# Altium schematic sheet Remote.SchDoc
size 431 x 279 mm; SheetNumber: 1; SheetTotal: 1; ENG_APP_DATE: --/--/--; DSN_APP_DATE: --/--/--; CHK_APP_DATE: --/--/--
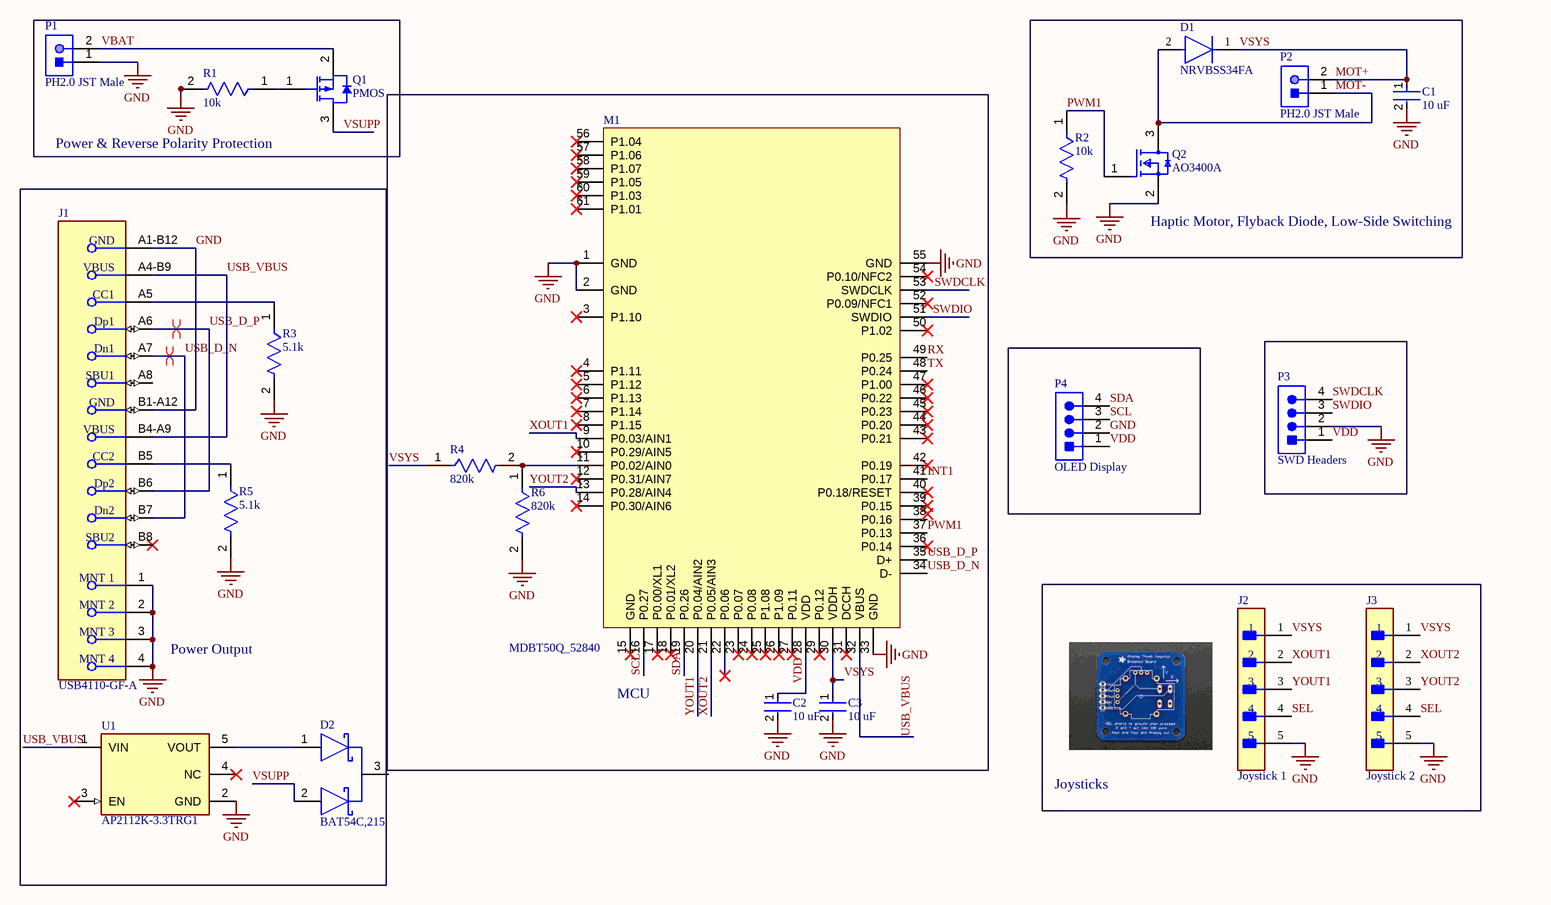
[diagram p0: Remote.SchDoc]

## Parts
C1  10 uF  [FP-1210-L_3_3_0_4-W_2_5_0-IPC_A]
C2  10 uF  [FP-1210-L_3_3_0_4-W_2_5_0-IPC_A]
C3  10 uF  [FP-1210-L_3_3_0_4-W_2_5_0-IPC_A]
D1  NRVBSS34FA  [FP-425AB-MFG]
D2  BAT54C,215  [FP-SOT23-MFG]
J1  USB4110-GF-A  [FP-USB4110-GF-A-MFG]
J2  Joystick 1  [FP-22-28-4050-MFG]
J3  Joystick 2  [FP-22-28-4050-MFG]
M1  MDBT50Q_52840  [MDBT50Q]
P1  PH2.0 JST Male  [JST-S2B-PH-K-S_V]
P2  PH2.0 JST Male  [JST-S2B-PH-K-S_V]
P3  SWD Headers  [SLIN-GRPB041VWVN-RC_V]
P4  OLED Display  [SLIN-GRPB041VWVN-RC_V]
Q1  PMOS  [AO-SOT-23-3L_V]
Q2  AO3400A  [FP-SOT23-MFG]
R1  10k  [FP-CRGCQ1210-IPC_C]
R2  10k  [FP-CRGCQ1210-IPC_C]
R3  5.1k  [FP-ESR10-IPC_C]
R4  820k  [FP-AC1206-MFG]
R5  5.1k  [FP-ESR10-IPC_C]
R6  820k  [FP-AC1206-MFG]
U1  AP2112K-3.3TRG1  [FP-SOT25-IPC_A]

## Blocks framed on the sheet
Power & Reverse Polarity Protection: P1 Q1 R1
Haptic Motor, Flyback Diode, Low-Side Switching: C1 D1 P2 Q2 R2
MCU: C2 C3 M1 R4 R6
Power Output: D2 J1 R3 R5 U1
Joysticks: J2 J3

## Nets
GND: C1.2 C2.2 C3.2 J1.1(MNT_1) J1.2(MNT_2) J1.3(MNT_3) J1.4(MNT_4) J1.A1-B12(GND) J1.B1-A12(GND) J2.5 J3.5 M1.1(GND) M1.2(GND) M1.33(GND) M1.55(GND) P1.1 P3.2 P4.2 Q2.2(S) R1.2 R2.2 R3.2 R5.2 R6.2 U1.2(GND)
INT1: M1.41(P0.17)
MOT+: C1.1 C3.1 D1.1(C) J2.1 J3.1 M1.30(VDDH) P2.2 R4.1  [also labelled VSYS]
MOT-: D1.2(A) P2.1 Q2.3(D)
PWM1: M1.37(P0.13) Q2.1(G) R2.1
RX: M1.49(P0.25)
SCL: M1.16(P0.27) P4.3
SDA: M1.19(P0.26) P4.4
SEL: J2.4 J3.4
SWDCLK: M1.53(SWDCLK) P3.4
SWDIO: M1.51(SWDIO) P3.3
TX: M1.48(P0.24)
USB_D_N: J1.A7(Dn1) J1.B7(Dn2) M1.34(D-)
USB_D_P: J1.A6(Dp1) J1.B6(Dp2) M1.35(D+)
USB_VBUS: J1.A4-B9(VBUS) J1.B4-A9(VBUS) M1.32(VBUS) U1.1(VIN)
VBAT: P1.2 Q1.2(SOURCE)
VDD: C2.1 M1.28(VDD) P3.1 P4.1
VSUPP: D2.2(2_ANODE) Q1.3(DRAIN)
XOUT1: J2.2 M1.9(P0.03/AIN1)
XOUT2: J3.2 M1.21(P0.05/AIN3)
YOUT1: J2.3 M1.20(P0.04/AIN2)
YOUT2: J3.3 M1.13(P0.28/AIN4)
NetD2_1: D2.1(1_ANODE) U1.5(VOUT)
NetJ1_A5: J1.A5(CC1) R3.1
NetJ1_B5: J1.B5(CC2) R5.1
NetM1_11: M1.11(P0.02/AIN0) R4.2 R6.1
NetQ1_1: Q1.1(GATE) R1.1

Not connected (* = marked no-connect by the designer): D2 3(COMMON_CATHODE); J1 A8(SBU1) B8(SBU2)*; M1 3(P1.10)* 4(P1.11)* 5(P1.12)* 6(P1.13)* 7(P1.14)* 8(P1.15)* 10(P0.29/AIN5)* 12(P0.31/AIN7)* 14(P0.30/AIN6)* 15(GND)* 17(P0.00/XL1)* 18(P0.01/XL2)* 22(P0.06)* 23(P0.07)* 24(P0.08)* 25(P1.08)* 26(P1.09)* 27(P0.11)* 29(P0.12)* 31(DCCH)* 36(P0.14)* 38(P0.16) 39(P0.15)* 40(P0.18/RESET)* 42(P0.19)* 43(P0.21)* 44(P0.20)* 45(P0.23)* 46(P0.22)* 47(P1.00)* 50(P1.02)* 52(P0.09/NFC1)* 54(P0.10/NFC2)* 56(P1.04)* 57(P1.06)* 58(P1.07)* 59(P1.05)* 60(P1.03)* 61(P1.01)*; U1 3(EN)* 4(NC)*

## Layout directives
differential pair: USB_D_N, USB_D_P

## Notes on the sheet
- DWG. NO.
- REV.
- SHT.
- THIS DOCUMENT AND THE DATA DISCLOSED HEREIN OR HEREWITH IS THE PROPERTY OF ALTIUM LIMITED AND MAY BE FREELY DISTRIBUTED IN WHOLE. NO RIGHTS ARE RESERVED OR EXPRESS OR IMPLIED WARANTEE GIVEN.
- REVISION
- DESCRIPTION
- DATE
- APPROVED
- ENG:
- APPROVALS
- PROJECT
- DSN:
- CHK:
- REFERENCE DOCUMENTS
- PROJECT REVISION:
- TITLE
- DOCUMENT REVISION:
- DESIGN ITEM:
- BOM:
- FAB DWG:
- PCB DWG:
- ASSY DWG:
- SCALE:
- SIZE
- B
- CAGE CODE
- FILE NAME
- DWG NO.
- SHEET
- OF
- REV

## Library data of the parts
C1-C3 = CMP-1038-02198-3: CAP CER 10UF 10V X7R 1210, 1210ZC106KAT2A; Dissipation Factor: 5%; Tolerance: 10%; Capacitance: 10uF; Voltage Rating (DC): 10V; Case Code (Imperial): 1210; Termination: SMD/SMT; Min Operating Temperature: -55°C; Max Operating Temperature: 125°C; Voltage: 10V; RoHS Compliant: Yes; Lead Free: Lead Free; Construction: Flat; Case/Package: 1210; Dielectric: X7R; Width: 0.098inch; REACH SVHC: No SVHC; Mount: Surface Mount; Case Code (Metric): 3225; Depth: 2.5mm; Series: 1210; Voltage Rating: 10V; Packaging: Tape and Reel; Length: 3.2mm; Thickness: 0.11inch; Package Quantity: 1; Height: 2.79mm; Radiation Hardening: No
D1 = CMP-00278-103808874-1: NRVBSS34FA Schottky Barrier Rectifier Diode 40V 3A 2-Pin SOD−123FL T/R; Manufacturer Lifecycle Status: ACTIVE; Max Junction Temperature (Tj): 125°C; Capacitance: 152pF; Peak Reverse Current: 500µA; Max Forward Surge Current (Ifsm): 80A; RoHS: Compliant; Forward Current: 3A; Height: 1.43mm; Max Operating Temperature: 125°C; Min Operating Temperature: -55°C; Lifecycle Status: Production; Max Repetitive Reverse Voltage (Vrrm): 40V; Reverse Voltage: 40V; NexarPartId: 103808874
D2 = CMP-14398-000007-1: DIODE ARRAY SCHOTTKY 30V SOT23; Manufacturer: Nexperia; Automotive Grade: Grade 0; Peak Reverse Current: 2uA; Forward Current: 200mA; Max Surge Forward Current: 600mA; Value: 10pF; Max Junction Temp: +150°C; Lead Free: Yes; Automotive: Yes; Device Class L1: Discrete Semiconductors; Digikey Description: DIODE ARRAY SCHOTTKY 30V SOT23; Reverse Voltage: 30V; ComponentLink2URL: https://assets.nexperia.com/documents/data-sheet/BAT54_SER.pdf; Device Class L2: Diodes; Category: Diode; Octopart: https://octopart.com/bat54c%2C215-nexperia-78738945; Package: SOT23; Mouser Description: Schottky Diodes, Rectifiers - Arrays SOT-23 (TO-236AB) 30V 200mA (DC) Surface Mount; RoHS: TRUE; Manufacturer Part Number: BAT54C,215; Temperature: to +150°C; Ambient Temperature Range Low: -55°C; Height: 1.1mm; Device Class L3: Schottky Diodes; Temperature Range High: +150°C; Footprint Url: https://assets.nexperia.com/documents/outline-drawing/SOT23.pdf; Capacitance: 10pF; Ambient Temperature Range High: +150°C; Ipc Land Pattern Name: SOT95P230X100-3; ComponentLink2Description: Datasheet
J1 = CMP-245163-000002-1: CONN USB 2.0 TYPE-C R/A SMT; Manufacturer: GCT; Conn Orientation: Right Angle; Usb Standard: USB 2.0; Voltage Rating: 20V; Current Rating: 3/4.25/1.25/0.25A; Number Of Contacts: 16; Is Female: yes; Shielding: true; Standoff Height: 0.1mm; Octopart: https://octopart.com/usb4110-gf-a-gct-103941985; Temperature: -40°C to +85°C; RoHS: TRUE; Automotive: No; Contact Material: Gold,Nickel; Device Class L1: Connectors; Device Class L2: USB Connectors; Package: 0; Lead Free: Yes; ComponentLink2URL: https://gct.co/files/drawings/usb4110.pdf; Temperature Range High: +85°C; Temperature Range Low: -40°C; Height: 3.46mm; Manufacturer Part Number: USB4110-GF-A; ComponentLink2Description: Datasheet; Device Class L3: unset; Digikey Description: CONN USB 2.0 TYPE-C R/A SMT; Category: Conn
J2 J3 = CMP-00257-00278173-1: 22-28-4050 KK® 254 Breakaway Header, Vertical, 5 Circuits, Tin (Sn) Plating, Mating Pin Length 6.09mm, 22-28-4050; NexarPartId: 278173; Voltage Rating: 250V; Number of Contacts: 5; Contact Resistance: 20mΩ; Gender: Male; Pitch: 2.54mm; Connector Type: Male Pin; Current Rating: 4A; Glow Wire Compliant: Non-compliant; Max Voltage Rating (DC): 250.25kV; Flammability Rating: UL94 V-0; Min Operating Temperature: 0°C; REACH SVHC: Unknown; Lead Free: Lead Free; Termination: Solder; RoHS: Compliant; Schedule B: 8536694040; Number of Circuits: 5; Mount: Through Hole; Lead Pitch: 2.54mm; Height: 2.29mm; Voltage Rating (DC): 250V; Max Operating Temperature: 75°C; Width: 2.49mm; Radiation Hardening: No; Contact Plating: Tin; Orientation: Vertical; Length: 12.7mm; Number of Rows: 1; Housing Material: Thermoplastic; Contact Material: Brass; Packaging: Bulk; Contact Mating Length: 6.096mm; Housing Color: Black; Color: Black; Number of Positions: 5
M1 = MDBT50Q_52840: MDBT50Q(52840)
P1 P2 = CMP-002-00030-2: Male Header, Pitch 2 mm, 1 x 2 Position, Height 4.8 mm, Tail Length 3.4 mm, -25 to 85 degC, RoHS, Bulk, S2B-PH-K-S(LF)(SN), LiPo header; Manufacturer: Japan Solderless Terminals; Package Reference: S2B-PH-K-S; Case/Package: S2B-PH-K-S; Datasheet URL: http://www.jst-mfg.com/product/pdf/eng/ePH.pdf; RoHS Compliant: Unknown; Datasheet Version: Dec-12; Gender: Male; Min Operating Temperature: -25°C; Max Operating Temperature: 85°C; Package Description: Male Header, Pitch 2 mm, 1 x 2 Position, Height 4.8 mm, Tail Length 3.4 mm; Connector Type: Header; Mounting Technology: SM
P3 P4 = CMP-2000-06373-1: Male Header, Pitch 1.27 mm, 1 x 4 Position, Height 4 mm, Tail Length 2.3 mm, -40 to 105 degC, RoHS, Bulk, GRPB041VWVN-RC; Manufacturer: Sullins; Mating Products: S9010E-04-ND / -CONNHEADER.050"4POSR/APCB / S9008E-04-ND / -CONNHEADER.050"4POSPCBGOLD / S9005E-04-ND / -CONNHEADER.050"4POSSMDGOLD; Other Names: S9014E-04; Dynamic Catalog: GRPB; Pitch: 0.050"(1.27mm); Number of Positions Loaded: All; Number of Positions: 4; Catalog Drawings: S9014ESeriesTop; Connector Type: Header,Unshrouded; Contact Finish Thickness: Flash; Number of Rows: 1; Contact Type: MalePin; Category: Connectors,Interconnects; Contact Mating Length: 0.118"(3.00mm); Family: RectangularConnectors-Headers,MalePins; Datasheet Version: Rev. C, 12/2008; Contact Finish: Gold; Termination: Solder; Manufacturer URL: http://www.sullinscorp.com/; Mounting Type: ThroughHole; Packaging: Bulk; Package Reference: GRPB041VWVN-RC; Datasheet URL: http://www.sullinscorp.com/drawings/71_GRPB___1VWVN-RC,_10957-C.pdf; Mounting Technology: ThroughHole; Package Description: Male Header, Pitch 1.27 mm, 1 x 4 Position, Height 4 mm, Tail Length 2.3 mm; Standard Package: 1
Q1 = CMP-2000-05778-1: P-Channel MOSFET, 30 V, 4 A, -55 to 150 degC, 3-Pin SOT-23-3L, RoHS, Tape and Reel, AO3401A; Manufacturer: Alpha and Omega; Output Power (Max): NotRequiredW; Power Dissipation: 1.4W; Rad Hardened: No; Drain Efficiency: NotRequired%; Drain-Source On-Volt: 30V; Noise Figure: NotRequireddB; Frequency (Max): NotRequiredMHz; Number of  Elements: 1; Gate-Source Voltage (Max): ?12V; Drain Current (Max): 4A; Channel Mode: Enhancement; Drain-Source On-Res: 0.044ohm; Type: PowerMOSFET; Polarity: P; Package URL: http://www.aosmd.com/res/packaging_information/SOT-23-3L.pdf; Datasheet URL: http://www.aosmd.com/res/data_sheets/AO3401A.pdf; Package Type: SOT-23; Package Description: 3-Pin Small Outline Transistor, Body 2.95 x 1.6 mm, Pitch 0.95 mm; Mounting: SurfaceMount; Manufacturer URL: http://www.aosmd.com/; Continuous Drain Current: 4A; Package Reference: SOT-23-3L; Mounting Technology: SurfaceMount; Operating Temperature Classification: Military; Power Gain: NotRequireddB; Datasheet Version: Rev. 3, 03/2011; Operating Temp Range: -55Cto150C; Pin Count: 3
Q2 = CMP-83955-000006-1: MOSFET N-CH 30V 5.7A SOT23; Input Capacitance: 630pF; Number of Elements: 1; Rds On Max: 26.5mR; Max Power Dissipation: 1.4W; Gate to Source Voltage (Vgs): 12V; Min Operating Temperature: -55°C; Lead Free: Lead Free; Number of Pins: 3; Drain to Source Voltage (Vdss): 30V; Case/Package: SOT-23; Mount: Surface Mount; Continuous Drain Current (ID): 5.7A; Radiation Hardening: No; Packaging: Tape and Reel; Max Operating Temperature: 150°C; Power Dissipation: 1.4W
R1 R2 = CMP-03211-008962-1: CRGCQ1210 10KΩ 0.5W ±100ppm/°C 5% 200V; Manufacturer Part Number: CRGCQ1210J10K; Manufacturer: TE Connectivity; Tolerance: 0.05; Automotive Grade: Grade 914; ComponentLink2Description: Datasheet; Temperature Range High: +155°C; Ipc Land Pattern Name: RESC310260X55; Height: 0.65mm; Automotive: Yes; Temperature Range Low: -55°C; RoHS: TRUE; Temperature: -55°C to +155°C; ComponentLink2URL: https://www.te.com/commerce/DocumentDelivery/DDEController?Action=showdoc&DocId=Data+Sheet%7F1773204-3%7F1%7Fpdf%7FEnglish%7FENG_DS_1773204-3_1.pdf%7F4-2176347-923; Device Class L2: Resistors; Power Rating: 0.5W; Lead Free: Yes; Voltage Rating: 200V; Ambient Temperature Range High: +70°C; Composition: Thick Film; Package: CRGCQ1210; Device Class L1: Passive Components; Value: 10KΩ; Series: CRGCQ; Temperature Coefficient: ±100ppm/°C; Category: Res; Octopart: https://octopart.com/crgcq1210j10k-te+connectivity-91018409; Resistance: 10KΩ; Device Class L3: Chip SMD Resistors
R3 R5 = CMP-08839-003638-1: 5.1kΩ ±5% 0.4W 0805 Anti-Surge Chip Resistor AEC-Q200; Max Power Dissipation: 400mW; Resistance: 5.1kR; Temperature Coefficient: 200ppm/°C; Series: ESR; Packaging: Tape and Reel; Height: 0.026inch; Min Operating Temperature: -55°C; Features: Automotive AEC-Q200; Package Quantity: 1; Case/Package: 0805; Length: 0.079inch; Contact Plating: Tin; Resistor Type: Thick Film; Max Operating Temperature: 155°C; Tolerance: 5%; Case Code (Metric): 2012; Width: 0.049inch; Case Code (Imperial): 0805; RoHS Compliant: Yes; Number of Terminations: 2
R4 R6 = CMP-03412-027672-1: RES SMD 820K OHM 1% 1/4W 1206, AC1206FR-07820KL; Manufacturer: Yageo; Voltage Rating: 200V; Value: 820KΩ; Automotive Grade: Grade 0; Tolerance: 0.01; Power Rating: 0.25W; Description: AC1206 820KΩ 0.25W 1.00%; ComponentLink2URL: http://www.yageo.com/NewPortal/yageodocoutput?fileName=/pdf/R-Chip/PYu-AC_51_RoHS_L_6.pdf; Resistance: 820KΩ; Device Class L1: Passive Components; Composition: Thick Film; Temperature Range Low: -55°C; Series: AC; ComponentLink2Description: Datasheet; Device Class L2: Resistors; Ipc Land Pattern Name: RESC310160X55; Lead Free: Yes; Package: AC1206; Octopart: https://octopart.com/ac1206fr-07820kl-yageo-71368214; Automotive: Yes; Digikey Description: RES SMD 820K OHM 1% 1/4W 1206; Height: 0.65mm; Manufacturer Part Number: AC1206FR-07820KL; Device Class L3: Chip SMD Resistors; Category: Res; RoHS: TRUE; Temperature Range High: +155°C; Footprint Url: http://www.yageo.com/exep/pages/download/literatures/PYu-R_Mount_10.pdf; Temperature: -55°C to +155°C
U1 = CMP-12756-000035-1: IC REG LINEAR 3.3V 600MA SOT25; Number of Regulators: 1; Output Type: Fixed; Polarity: Positive; Min Input Voltage: 2.5V; Max Input Voltage: 6V; Accuracy: 1.5%; Quiescent Current: 55uA; Dropout Voltage: 250mV; Min Operating Temperature: -40°C; Length: 3.1mm; Output Current: 600mA; Max Operating Temperature: 85°C; Package Quantity: 1; Output Voltage: 3.3V; Width: 1.7mm; Number of Outputs: 1; Packaging: Tape and Reel; Height: 1.3mm; Lead Free: Lead Free; Max Output Current: 600mA; Case/Package: SOT-23-5; Mount: Surface Mount; Number of Pins: 5